# Altium schematic sheet Project.SchDoc
size A4
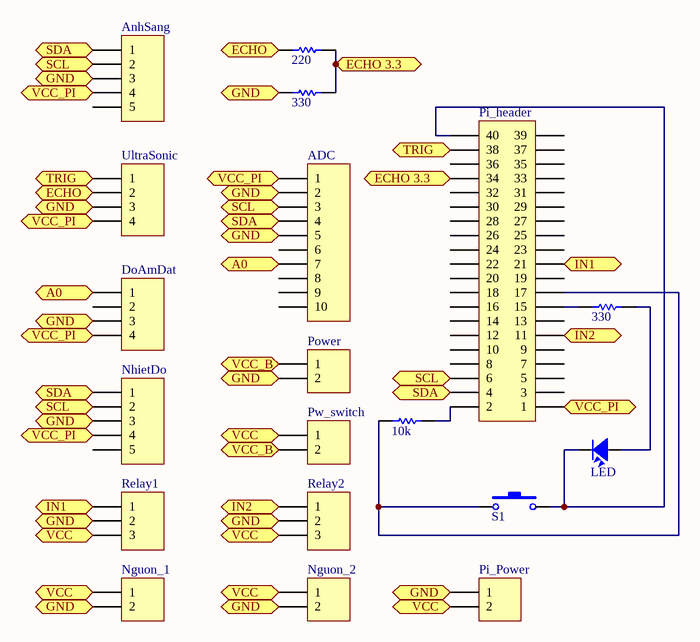
[diagram p0: Project.SchDoc]

## Parts
ADC  Header 10  [HDR1X10]  (value not drawn)
AnhSang  Header 5  [HDR1X5]  (value not drawn)
DoAmDat  (no value)  [HDR1X4]
LED  LED  [LED-5-Green]  (value not drawn)
Nguon_1  Header 2  [HDR1X2]  (value not drawn)
Nguon_2  Header 2  [HDR1X2]  (value not drawn)
NhietDo  Header 5  [HDR1X5]  (value not drawn)
Pi_header  Header 20X2  [HDR2X20]  (value not drawn)
Pi_Power  Header 2  [HDR1X2]  (value not drawn)
Power  Header 2  [HDR1X2]  (value not drawn)
Pw_switch  Header 2  [HDR1X2]  (value not drawn)
R1  value 220  [R1/4W]  (hidden comment: Res1)
R2  value 330  [R1/4W]  (hidden comment: Res1)
R3  value 10k  [R1/4W]  (hidden comment: Res1)
R4  value 330  [R1/4W]  (hidden comment: Res1)
Relay1  Header 3  [HDR1X3]  (value not drawn)
Relay2  Header 3  [HDR1X3]  (value not drawn)
S1  SW  [BUTTON  ROUND.CAOVANHUONG]  (value not drawn)
UltraSonic  (no value)  [HDR1X4]

## Ports
A0, ECHO, ECHO 3.3, GND, IN1, IN2, SCL, SDA, TRIG, VCC, VCC_B, VCC_PI

## Nets
A0: ADC.7 DoAmDat.1 ; port A0
ECHO: R1.1 UltraSonic.2 ; port ECHO
ECHO 3.3: Pi_header.34 R1.2 R2.1 ; port ECHO 3.3
GND: ADC.2 ADC.5 AnhSang.3 DoAmDat.3 Nguon_1.2 Nguon_2.2 NhietDo.3 Pi_Power.1 Power.2 R2.2 Relay1.2 Relay2.2 UltraSonic.3 ; port GND
IN1: Pi_header.21 Relay1.1 ; port IN1
IN2: Pi_header.11 Relay2.1 ; port IN2
SCL: ADC.3 AnhSang.2 NhietDo.2 Pi_header.6 ; port SCL
SDA: ADC.4 AnhSang.1 NhietDo.1 Pi_header.4 ; port SDA
TRIG: Pi_header.38 UltraSonic.1 ; port TRIG
VCC: Nguon_1.1 Nguon_2.1 Pi_Power.2 Pw_switch.1 Relay1.3 Relay2.3 ; port VCC
VCC_B: Power.1 Pw_switch.2 ; port VCC_B
VCC_PI: ADC.1 AnhSang.4 DoAmDat.4 NhietDo.4 Pi_header.1 UltraSonic.4 ; port VCC_PI
NetLED_1: LED.1 R4.1
NetLED_2: LED.2 Pi_header.40 S1.2
NetPi_header_2: Pi_header.2 R3.2
NetPi_header_15: Pi_header.15 R4.2
NetPi_header_17: Pi_header.17 R3.1 S1.1

Not connected (* = marked no-connect by the designer): ADC 6 8 9 10; AnhSang 5; DoAmDat 2; NhietDo 5; Pi_header 3 5 7 8 9 10 12 13 14 16 18 19 20 22 23 24 25 26 27 28 29 30 31 32 33 35 36 37 39

## Library data of the parts
ADC = Header 10: Header, 10-Pin; LatestRevisionDate: 17-Jul-2002; LatestRevisionNote: Re-released for DXP Platform.; Publisher: Altium Limited
AnhSang NhietDo = Header 5: Header, 5-Pin; LatestRevisionDate: 17-Jul-2002; LatestRevisionNote: Re-released for DXP Platform.; Publisher: Altium Limited
DoAmDat UltraSonic = Header 4: Header, 4-Pin; LatestRevisionDate: 17-Jul-2002; LatestRevisionNote: Re-released for DXP Platform.; Publisher: Altium Limited
LED = LED: LED Single colour Green and Red; Value: LED 3 ly Single Colour
Nguon_1 Nguon_2 Pi_Power Power Pw_switch = Header 2: Header, 2-Pin; LatestRevisionDate: 17-Jul-2002; LatestRevisionNote: Re-released for DXP Platform.; Publisher: Altium Limited
Pi_header = Header 20X2: Header, 20-Pin, Dual row; LatestRevisionDate: 17-Jul-2002; LatestRevisionNote: Re-released for DXP Platform.; Publisher: Altium Limited
R1-R4 = Res1_1: Resistor; Manufacturer: Generic Components; Class: Passive; Published: 08/06/2000; Publisher: Altium Hobart Technology Centre; SubClass: Resistor
Relay1 Relay2 = Header 3: Header, 3-Pin; LatestRevisionDate: 17-Jul-2002; LatestRevisionNote: Re-released for DXP Platform.; Publisher: Altium Limited
S1 = SW-Button: Switch-Button; Published: 24-Mar-1999; LatestRevisionDate: 17-Jul-2002; LatestRevisionNote: Re-released for DXP Platform.; PackageReference: SPST-2; Publisher: Altium Limited